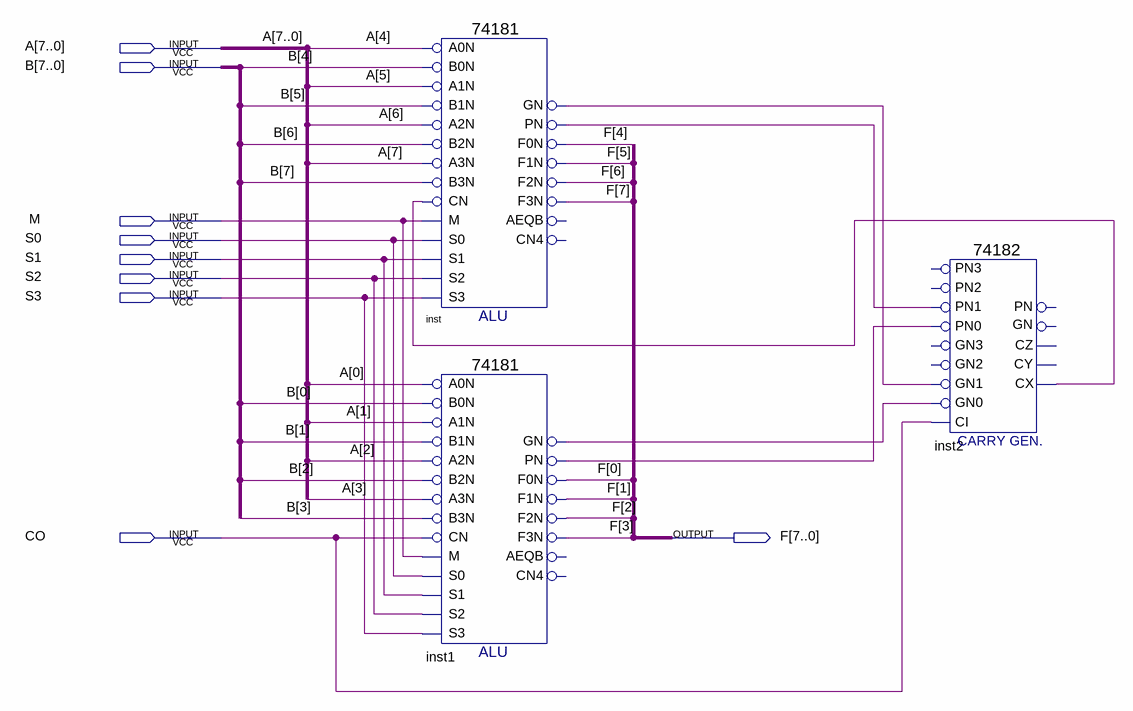
[diagram p0: schematic sheet]
// Quartus schematic ALU2.bdf as structural Verilog: 3 symbols, 9 pins
module ALU2 (
  input  [7:0] A,
  input  [7:0] B,
  input  M,
  input  S0,
  input  S1,
  input  S2,
  input  S3,
  input  CO,
  output [7:0] F
);

  wire inst1_gn, inst1_pn, inst2_cx, inst_gn, inst_pn;

  \74181  inst (
    .B0N(B[4]), .A0N(A[4]), .A1N(A[5]), .B1N(B[5]), .A3N(A[7]), .B2N(B[6]), .A2N(A[6]), .M(M), .CN(inst2_cx),
    .B3N(B[7]), .S2(S2), .S1(S1), .S0(S0), .S3(S3), .PN(inst_pn), .GN(inst_gn), .F3N(F[7]), .F1N(F[5]),
    .F0N(F[4]), .F2N(F[6]));  // open: AEQB, CN4
  \74181  inst1 (
    .B0N(B[0]), .A0N(A[0]), .A1N(A[1]), .B1N(B[1]), .A3N(A[3]), .B2N(B[2]), .A2N(A[2]), .M(M), .CN(CO),
    .B3N(B[3]), .S2(S2), .S1(S1), .S0(S0), .S3(S3), .PN(inst1_pn), .GN(inst1_gn), .F3N(F[3]), .F1N(F[1]),
    .F0N(F[0]), .F2N(F[2]));  // open: AEQB, CN4
  \74182  inst2 (
    .CI(CO), .PN1(inst_pn), .PN0(inst1_pn), .GN1(inst_gn), .GN0(inst1_gn), .CX(inst2_cx));  // open: PN2, GN2, GN3, PN3, CY, PN, CZ, GN
endmodule
